# Altium schematic sheet MainBOB_RUDRV2.SchDoc
size 558 x 431 mm; SheetNumber: 1; SheetTotal: 2
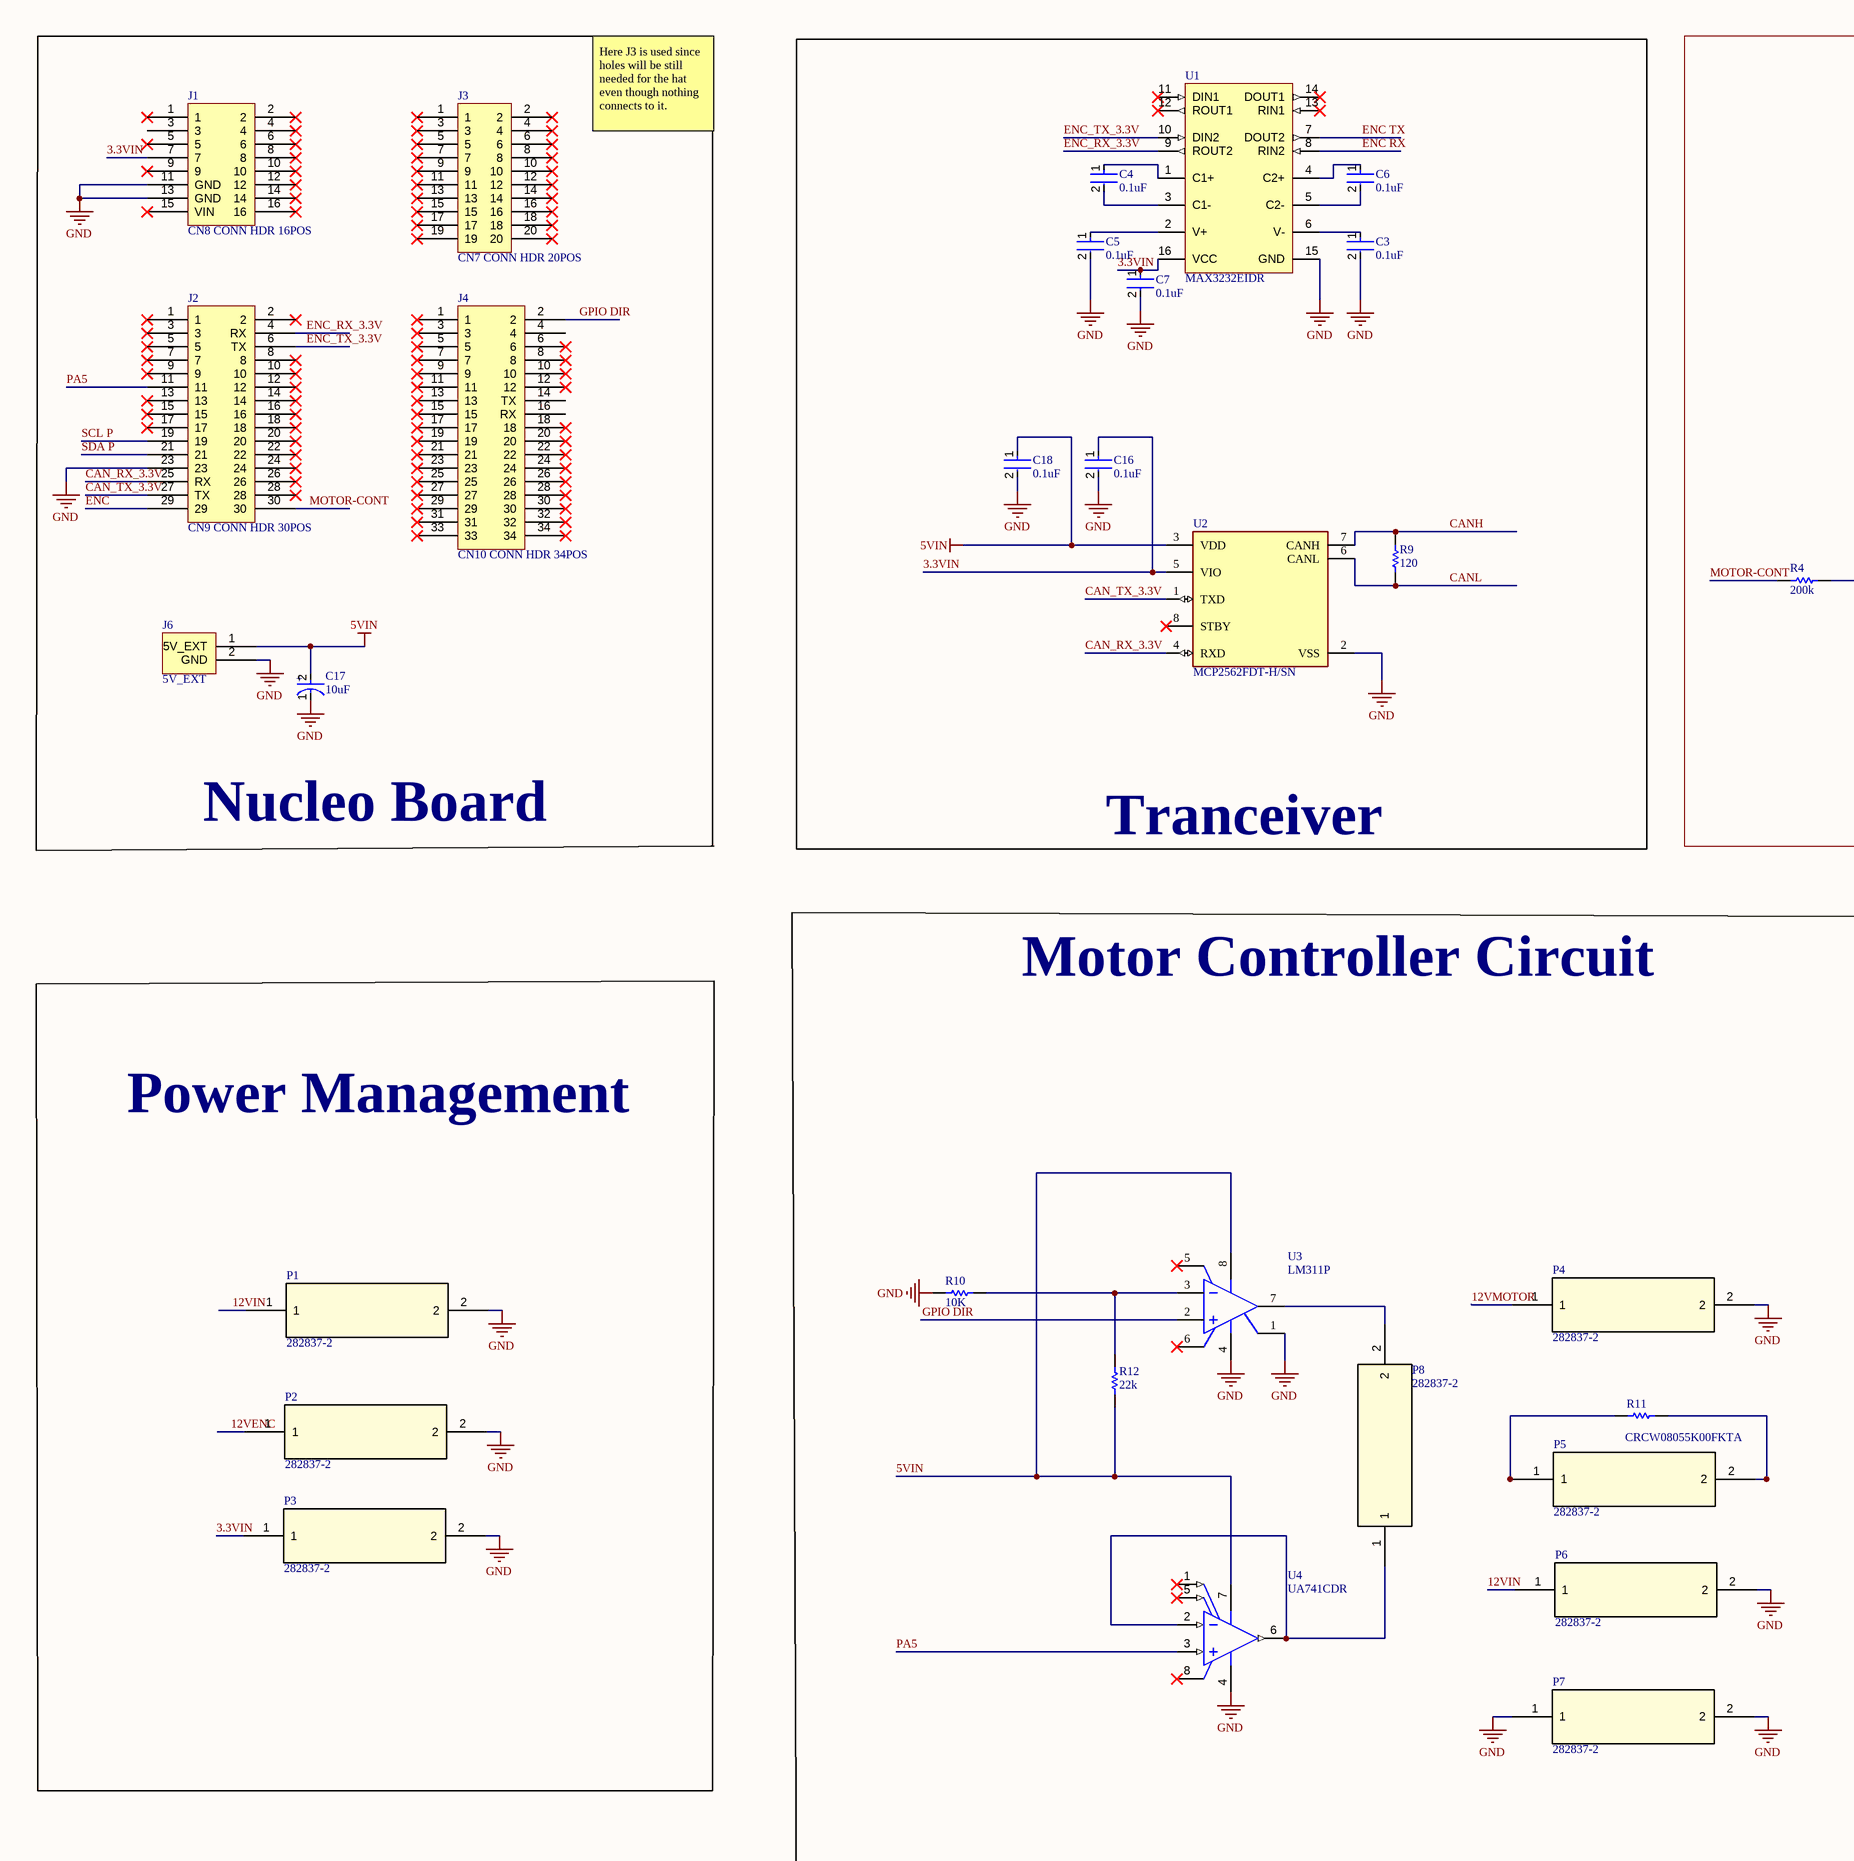
[diagram p0: MainBOB_RUDRV2.SchDoc, left]
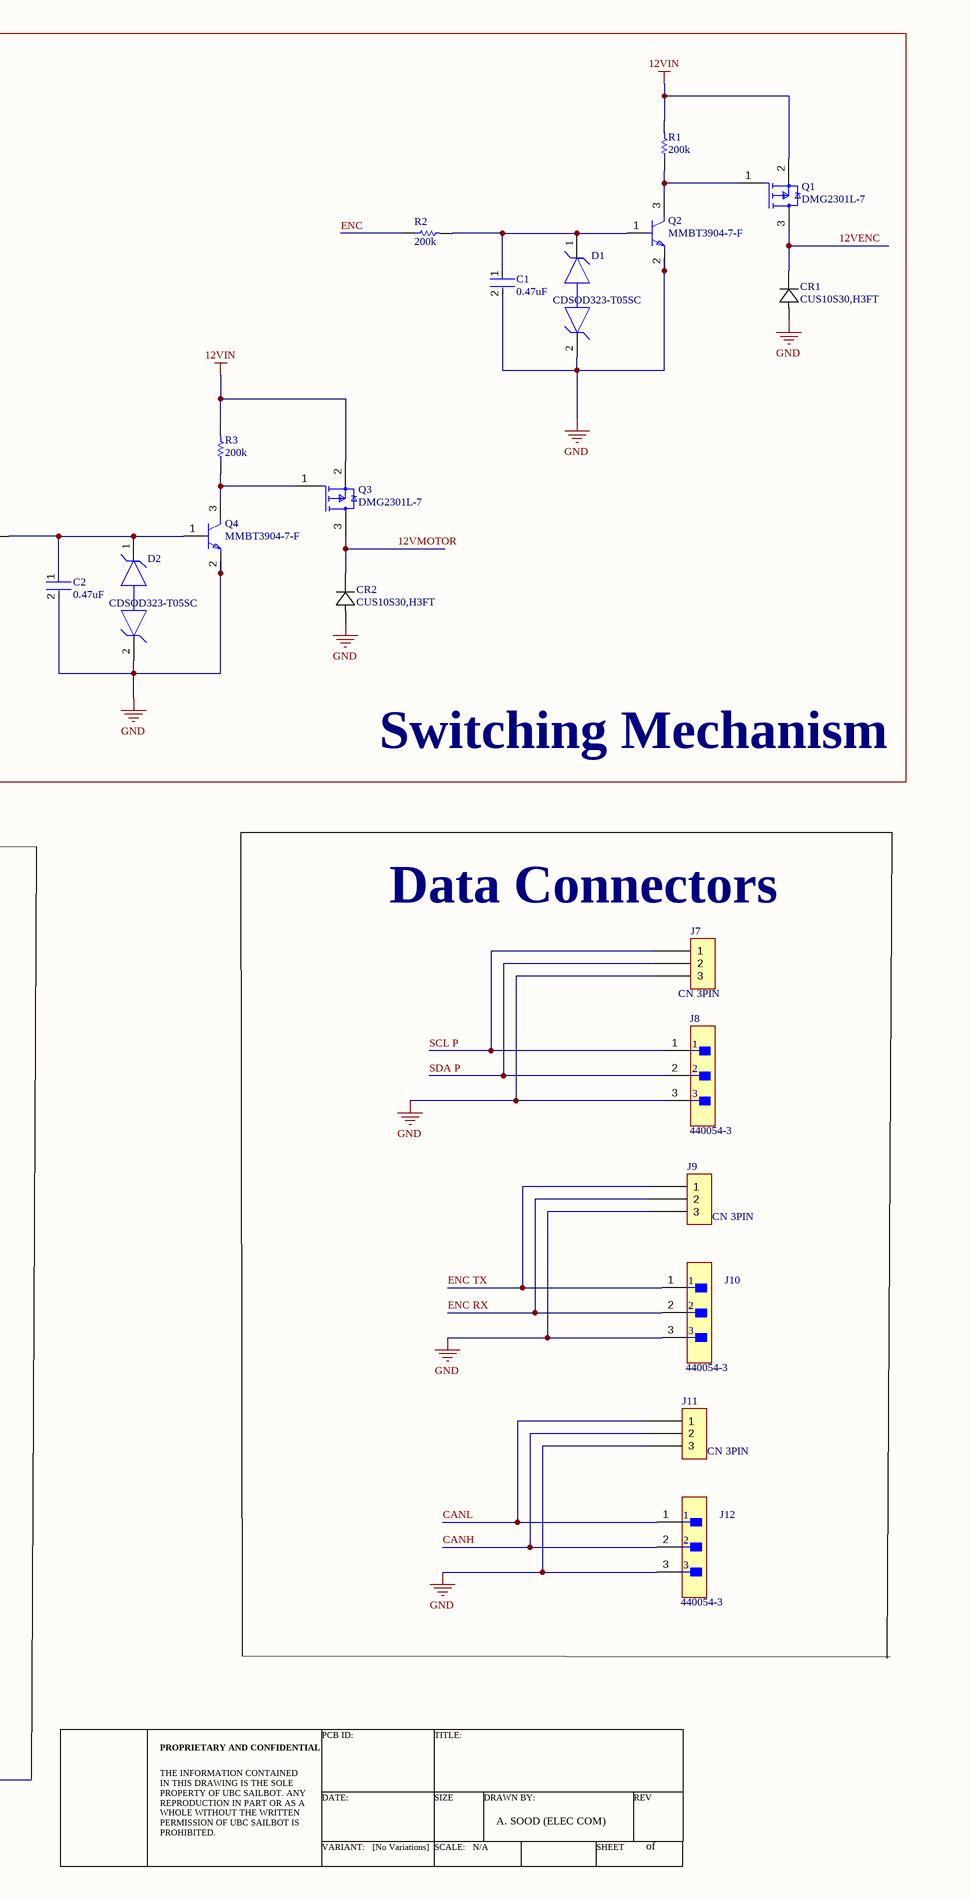
[diagram p1: MainBOB_RUDRV2.SchDoc, right]

## Parts
*  Title Block  (value not drawn)
C1  0.47uF  [FP-GRM21B-0_15-IPC_B]
C2  0.47uF  [FP-GRM21B-0_15-IPC_B]
C3  0.1uF  [FP-GCM21B-0_15-MFG]
C4  0.1uF  [FP-GCM21B-0_15-MFG]
C5  0.1uF  [FP-GCM21B-0_15-MFG]
C6  0.1uF  [FP-GCM21B-0_15-MFG]
C7  0.1uF  [FP-GCM21B-0_15-MFG]
C16  0.1uF  [FP-GCM21B-0_15-MFG]
C17  10uF  [FP-FKC-MFG]
C18  0.1uF  [FP-GCM21B-0_15-MFG]
CR1  CUS10S30,H3FT  [USC_TOS]
CR2  CUS10S30,H3FT  [USC_TOS]
D1  CDSOD323-T05SC  [FP-SOD-323-CA-MFG]
D2  CDSOD323-T05SC  [FP-SOD-323-CA-MFG]
J1  CN8 CONN HDR 16POS  [CN8_8X2_PADS]
J2  CN9 CONN HDR 30POS  [CN9_15X2_PADS]
J3  CN7 CONN HDR 20POS  [CN7_10X2_PADS]
J4  CN10 CONN HDR 34POS  [CN10_17X2_PADS]
J6  5V_EXT  [5V_EXT]
J7  CN 3PIN  [3X1 CON]
J8  440054-3  [FP-440054-3-MFG]
J9  CN 3PIN  [3X1 CON]
J10  440054-3  [FP-440054-3-MFG]
J11  CN 3PIN  [3X1 CON]
J12  440054-3  [FP-440054-3-MFG]
P1  282837-2  [282837-2_TYC]
P2  282837-2  [282837-2_TYC]
P3  282837-2  [282837-2_TYC]
P4  282837-2  [282837-2_TYC]
P5  282837-2  [282837-2_TYC]
P6  282837-2  [282837-2_TYC]
P7  282837-2  [282837-2_TYC]
P8  282837-2  [282837-2_TYC]
Q1  DMG2301L-7  [FP-SOT23-MFG]
Q2  MMBT3904-7-F  [FP-SOT23-IPC_A]
Q3  DMG2301L-7  [FP-SOT23-MFG]
Q4  MMBT3904-7-F  [FP-SOT23-IPC_A]
R1  200k  [RESC2013X70X40LL20T20]
R2  200k  [RESC2013X70X40LL20T20]
R3  200k  [RESC2013X70X40LL20T20]
R4  200k  [RESC2013X70X40LL20T20]
R9  120  [RESC2013X60X35ML10T20]
R10  10K  [RESC2013X60X40LL20T25_A]
R11  CRCW08055K00FKTA  [RESC2013X50X30ML20T20]
R12  22k  [RESC2013X60X40ML20T25]
U1  MAX3232EIDR  [D0016A_N]
U2  MCP2562FDT-H/SN  [FP-C04-057-SN-IPC_A]
U3  LM311P  [FP-P0008A-MFG]
U4  UA741CDR  [D0008A_L]

## Blocks framed on the sheet
Nucleo Board: C17 J1-J4 J6
Switching Mechanism: C1 C2 CR1 CR2 D1 D2 Q1-Q4 R1-R4
Tranceiver: C3-C7 C16 C18 R9 U1 U2
Power Management: P1-P3

## Nets
5VIN: C17.2(A) C18.1 J6.1(5V_EXT) R12.1 U2.3(VDD) U3.8(VCC+) U4.7(VCC+)
12VIN: P1.1 P6.1 Q1.2(S) Q3.2(S) R1.2 R3.2
GND: C1.2 C2.2 C3.2 C5.2 C7.2 C16.2 C17.1(C) C18.2 CR1.2(anode) CR2.2(anode) D1.2 D2.2 J1.11(GND) J1.13(GND) J2.23 J6.2(GND) J7.3 J8.3 J9.3 J10.3 J11.3 J12.3 P1.2 P2.2 P3.2 P4.2 P6.2 P7.1 P7.2 Q2.2(E) Q4.2(E) R10.1 U1.15(GND) U2.2(VSS) U3.1(EMIT_OUT) U3.4(VCC-) U4.4(VCC-)
3.3VIN: C7.1 C16.1 J1.7 P3.1 U1.16(VCC) U2.5(VIO)
12VENC: CR1.1(cathode) P2.1 Q1.3(D)
12VMOTOR: CR2.1(cathode) P4.1 Q3.3(D)
CAN_RX_3.3V: J2.25(RX) U2.4(RXD)
CAN_TX_3.3V: J2.27(TX) U2.1(TXD)
CANH: J11.2 J12.2 R9.1 U2.7(CANH)
CANL: J11.1 J12.1 R9.2 U2.6(CANL)
ENC: J2.29 R2.1
ENC RX: J9.2 J10.2 U1.8(RIN2)
ENC TX: J9.1 J10.1 U1.7(DOUT2)
ENC_RX_3.3V: J2.4(RX) U1.9(ROUT2)
ENC_TX_3.3V: J2.6(TX) U1.10(DIN2)
GPIO DIR: J4.2 U3.2(IN+)
MOTOR-CONT: J2.30 R4.1
PA5: J2.11 U4.3(IN+)
SCL P: J2.19 J7.1 J8.1
SDA P: J2.21 J7.2 J8.2
NetC1_1: C1.1 D1.1 Q2.1(B) R2.2
NetC2_1: C2.1 D2.1 Q4.1(B) R4.2
NetC3_1: C3.1 U1.6(V-)
NetC4_1: C4.1 U1.1(C1+)
NetC4_2: C4.2 U1.3(C1-)
NetC5_1: C5.1 U1.2(V+)
NetC6_1: C6.1 U1.4(C2+)
NetC6_2: C6.2 U1.5(C2-)
NetP5_1: P5.1 R11.1
NetP5_2: P5.2 R11.2
NetP8_1: P8.1 U4.2(IN-) U4.6(OUT)
NetP8_2: P8.2 U3.7(COL_OUT)
NetQ1_1: Q1.1(G) Q2.3(C) R1.1
NetQ3_1: Q3.1(G) Q4.3(C) R3.1
NetR10_2: R10.2 R12.2 U3.3(IN-)

Not connected (* = marked no-connect by the designer): J1 1* 2* 3 4* 5* 6* 8* 9* 10* 12* 14* 15(VIN)* 16*; J2 1* 2* 3* 5* 7* 8* 9* 10* 12* 13* 14* 15* 16* 17* 18* 20* 22* 24* 26* 28*; J3 1* 2* 3* 4* 5* 6* 7* 8* 9* 10* 11* 12* 13* 14* 15* 16* 17* 18* 19* 20*; J4 1* 3* 4 5* 6* 7* 8* 9* 10* 11* 12* 13* 14(TX) 15* 16(RX) 17* 18* 19* 20* 21* 22* 23* 24* 25* 26* 27* 28* 29* 30* 31* 32* 33* 34*; U1 11(DIN1)* 12(ROUT1)* 13(RIN1)* 14(DOUT1)*; U2 8(STBY)*; U3 5(BALANCE)* 6(BAL/STRB)*; U4 1(OFFSET_N1)* 5(OFFSET_N2)* 8(NC)*

## Notes on the sheet
- Here J3 is used since holes will be still needed for the hat even though nothing connects to it.
- Motor Controller Circuit
- (near J7) Data Connectors
- C
- of
- DWG. NO.
- REV.
- SHT.
- REVISION
- DESCRIPTION
- DATE
- APPROVED
- THIS DOCUMENT AND THE DATA DISCLOSED HEREIN OR HEREWITH IS THE PROPERTY OF ALTIUM LIMITED AND MAY BE FREELY DISTRIBUTED IN WHOLE. NO RIGHTS ARE RESERVED OR EXPRESS OR IMPLIED WARANTEE GIVEN.
- ENG:
- DSN:
- APPROVALS
- PROJECT
- DOCUMENT REVISION:
- DESIGN ITEM:
- CHK:
- BOM:
- REFERENCE DOCUMENTS
- PROJECT REVISION:
- TITLE
- FAB DWG:
- PCB DWG:
- ASSY DWG:
- SCALE:
- SIZE
- CAGE CODE
- FILE NAME
- DWG NO.
- SHEET
- OF
- REV
- (in symbol CMP-05427-000030-1) +
- (in symbol Title Block) PCB ID:; TITLE:; PROPRIETARY AND CONFIDENTIAL; DATE:; SIZE; DRAWN BY:; REV; A. SOOD (ELEC COM); A; THE INFORMATION CONTAINED IN THIS DRAWING IS THE SOLE PROPERTY OF UBC SAILBOT. ANY REPRODUCTION IN PART OR AS A WHOLE WITHOUT THE WRITTEN PERMISSION OF UBC SAILBOT IS PROHIBITED.; VARIANT:   [No Variations]; SCALE:   N/A; SHEET

## Library data of the parts
C1 C2 = CMP-2007-03605-2: Chip Multilayer Ceramic Capacitors for General Purpose, 0805, 0.47uF, X7R, 15%, 10%, 100V; Capacitance: 470nF; Max Operating Temperature: 125°C; Dielectric: X7R; Length: 2mm; Case/Package: 0805; Case Code (Metric): 2012; Package Quantity: 1; Case Code (Imperial): 0805; REACH SVHC: No SVHC; Termination: SMD/SMT; Voltage Rating: 100V; Mount: Surface Mount; Depth: 1.25mm; Radiation Hardening: No; Width: 1.25mm; Material: Ceramic; Voltage: 100V; Voltage Rating (DC): 100V; Min Operating Temperature: -55°C; Thickness: 0.053inch; Packaging: Tape and Reel; Height: 1.25mm; Lead Free: Lead Free; Tolerance: 10%
C3-C7 C16 C18 = CMP-2007-03364-2: Ceramic Capacitor for Automotive 100nF ±10% 100VDC X7R 0805 Embossed T/R; Voltage Rating: 100V; Termination: SMD/SMT; Tolerance: 10%; Case Code (Imperial): 0805; Length: 2mm; Max Operating Temperature: 125°C; Case/Package: 0805; Mount: Surface Mount; Packaging: Tape and Reel; Package Quantity: 1; Min Operating Temperature: -55°C; Case Code (Metric): 2012; Radiation Hardening: No; REACH SVHC: No SVHC; Dielectric: X7R; Depth: 1.25mm; Lead Free: Lead Free; Ratings: AEC-Q200; Height: 1.25mm; Voltage: 100V; Capacitance: 100nF; Voltage Rating (DC): 100V; Width: 0.049inch; Thickness: 0.055inch
C17 = CMP-05427-000030-1: CAP ALUM 10UF 20% 50V SMD; Impedance: 1.52R; Ripple Current (AC): 85mA; Life (Hours): 2000Hour; Leakage Current: 3uA; Dielectric Material: Aluminium; Length: 5.8mm; Voltage Rating: 50V; Radiation Hardening: No; Max Operating Temperature: 105°C; REACH SVHC: No SVHC; Tolerance: 20%; RoHS Compliant: Yes; Case/Package: Radial; Height: 5.8mm; Voltage: 50V; Diameter: 5mm; Number of Pins: 2; Ripple Current: 85mA; Series: FK; Lead Free: Lead Free; Width: 6.5mm; ESR (Equivalent Series Resistance): 1.52R; Package Quantity: 1000; Construction: Cylindrical; Voltage Rating (DC): 50V; Packaging: Tape and Reel; Height - Seated (Max): 0.228inch; Contact Plating: Tin; Capacitance: 10uF; Min Operating Temperature: -55°C; Termination: SMD/SMT; Material: Aluminium; Mount: Surface Mount
CR1 CR2 = CUS10S30,H3FT: No Description Available; Mfr_Name: Toshiba Electronic Devices & Storage Corp.
D1 D2 = CMP-07401-000040-1: TVS DIODE 5VWM 14.5VC SOD323; Direction: Bidirectional; Number of Bidirectional Channels: 1; Clamping Voltage: 13.5V; Diode Type: ZENER; Element Configuration: Single; Power Line Protection: No; Leakage Current: 10uA; Max Power Dissipation: 400W; Test Current: 1mA; Peak Pulse Current: 28A; Working Voltage: 5V; Min Breakdown Voltage: 6V; Capacitance: 350pF; Peak Pulse Power: 500W; Mount: Surface Mount; Contact Plating: Tin; Max Operating Temperature: 150°C; Min Operating Temperature: -55°C; Packaging: Tape and Reel; REACH SVHC: No SVHC; Length: 1.9mm; RoHS Compliant: Yes; Series: CDSOD323; Number of Channels: 1; Number of Elements: 1; Reverse Standoff Voltage: 5V; Termination: SMD/SMT; Number of Pins: 2; Max Breakdown Voltage: 6V; Package Quantity: 3000; Depth: 1.45mm; Polarity: Bidirectional; Radiation Hardening: No; Max Surge Current: 28A; Breakdown Voltage: 6V; Reverse Breakdown Voltage: 6V; Resistor Type: Zener; Operating Supply Voltage: 5V
J1 = CN8 CONN HDR 16POS: CN8 CONN HDR 16POS 0.1 STACK
J2 = CN9 CONN HDR 30POS: CN9 CONN HDR 30 POS  0.1 STACK
J3 = CN7 CONN HDR 20POS: CN7 CONN HDR 20 POS  0.1 STACK
J4 = CN10 CONN HDR 34POS: CN10 CONN HDR 34 POS  0.1 STACK
J8 J10 J12 = CMP-03369-000008-1: CONN HEADER VERT 3POS 2MM; Manufacturer: TE Connectivity; Voltage Rating: 250V; Number Of Contacts: 3; Conn Gender: Male; Conn Orientation: Vertical; Current Rating: 3A; Octopart: https://octopart.com/440054-3-te+connectivity-40394845; Device Class L3: unset; Device Class L1: Connectors; Number Of Rows: 1; Temperature: -25°C to +105°C; Temperature Range Low: -25°C; Automotive: No; Package: 0; Manufacturer Part Number: 440054-3; ComponentLink2URL: https://www.te.com/usa-en/product-440054-3.datasheet.pdf; Device Class L2: Headers and Wire Housings; Temperature Range High: +105°C; Digikey Description: CONN HEADER VERT 3POS 2MM; Contact Material: Tin,Nickel; Footprint Url: https://www.te.com/commerce/DocumentDelivery/DDEController?Action=showdoc&DocId=Customer+Drawing%7F440054%7FF6%7Fpdf%7FEnglish%7FENG_CD_440054_F6.pdf%7F440054-3; RoHS: TRUE; ComponentLink2Description: Datasheet; Mouser Description: Headers & Wire Housings 3 POS HDR VERT 2.0mm; Lead Free: Yes; Category: Conn; Height: 6.35mm; Pitch: 2mm
P1-P8 = 282837-2: No Description Available; Mfr_Name: TE Connectivity; RefDes: RefDes; Type: Type
Q1 Q3 = CMP-12801-000065-1: MOSFET P-CH 20V 3A SOT23; Manufacturer: Diodes Inc.; Number Of Channels: 1; Turn On Delay Time: 5ns; Drain To Source Resistance: 120mΩ; Max Junction Temp: +150°C; Gate To Source Voltage: 8V; Power Dissipation: 1.5W; Rthja Max: 83°C/W; Max Forward Diode Voltage: -1.2V; Standoff Height: 0.013mm; Threshold Vgs Min: -0.4V; Input Capacitace At Vds: 476pF @ -10V; Depletion Mode: False; Gate Charge At Vgs: 5.5nC @ -4.5V; Pulse Drain Current: -10A; Drain To Source Voltage: -20V; Continuous Drain Current: -3A; Turn Off Delay Time: 30ns; Lead Free: Yes; Package: SOT23; ComponentLink2Description: Datasheet; Device Class L3: MOSFETs; Device Class L1: Discrete Semiconductors; Manufacturer Part Number: DMG2301L-7; Automotive: No; Height: 1.1mm; Category: Trans; Temperature Range High: +150°C; Digikey Description: MOSFET P-CH 20V 3A SOT23; RoHS: TRUE; Number Of P Channels: 1; Footprint Url: https://www.diodes.com/assets/Package-Files/SOT23.pdf; Octopart: https://octopart.com/dmg2301l-7-diodes+inc.-67250456; ComponentLink2URL: https://www.diodes.com/assets/Datasheets/DMG2301L.pdf; Mouser Description: Single P-Channel 20 V 1.5 W 5.5 nC Silicon Surface Mount Mosfet - SOT-23; Drain To Source Breakdown Voltage: -20V; Threshold Vgs Max: -1.2V; Device Class L2: Transistors; Temperature: -55°C to +150°C; Temperature Range Low: -55°C
Q2 Q4 = CMP-2000-04931-2: TRANS NPN 40V 0.2A SMD SOT23-3; Frequency: 300MHz; Power Dissipation: 350mW; Element Configuration: Single; Max Power Dissipation: 300mW; Max Collector Current: 200mA; Collector Emitter Saturation Voltage: 300mV; Number of Elements: 1; hFE Min: 100; Collector Base Voltage (VCBO): 60V; Emitter Base Voltage (VEBO): 6V; Contact Plating: Tin; Package Quantity: 3000; Max Frequency: 300MHz; REACH SVHC: No SVHC; Max Operating Temperature: 150°C; Width: 1.4mm; Collector Emitter Voltage (VCEO): 40V; Voltage Rating (DC): 40V; Radiation Hardening: No; Case/Package: SOT-23; Height: 1mm; Collector Emitter Breakdown Voltage: 40V; Length: 3.05mm; Polarity: NPN; Packaging: Tape and Reel; Number of Pins: 3; Min Operating Temperature: -55°C; Gain Bandwidth Product: 300MHz; Mount: Surface Mount; Weight: 0.000282oz; Continuous Collector Current: 200mA; Transition Frequency: 300MHz; Max Breakdown Voltage: 40V; Lead Free: Lead Free
R1-R4 = CMP-2001-00028-1: Manufacturer: Panasonic; Part Number: ERJ-6ENF2003V
R9 = CMP-2100-03671-1: Chip Resistor, 1 KOhm, +/- 1%, 125 mW, -55 to 155 degC, 0805 (2012 Metric), RoHS, Tape and Reel; Manufacturer: Yageo; Temperature Coefficient: 100ppm/degreesC; Voltage Rating (DC): 150V; Max Power Dissipation: 125mW; Resistance: 1KOhm; Number of Pins: 2; Number of Terminations: 2; Datasheet URL: http://www.yageo.com/NewPortal/yageodocoutput?fileName=/pdf/R-Chip/PYu-RC_Group_51_RoHS_L_5.pdf; Length: 0.079inch; Package Description: 2-Pin Surface Mounted Device, Body 2 x 1.25 mm; Depth: 1.25mm; Height: 0.024inch; Military Standard: Not; Case/Package: 0805; Package Reference: 0805; RoHSCompliant: true; Lead Free: LeadFree; Packaging: TapeandReel; Package Quantity: 1; Datasheet Version: Rev. 5, 10/2016; Tolerance: 1%; Min Operating Temperature: -55degC; Voltage Rating: 150V; Composition: ThickFilm; Case Code (Imperial): 0805; Power Rating: 125mW; Width: 0.049inch; Case Code (Metric): 2012; Manufacturer URL: http://www.yageo.com/; Max Operating Temperature: 155degC; REACH SVHC: Unknown; Termination: SMD/SMT
R10 = CMP-2001-00582-2: Metal Film Chip Resistor, High Reliability Type, 0.125 W, +/- 0.1%, -55 to 155 degC, 0805 (2012 Metric), RoHS, Tape and Reel; Voltage Rating: 100V; Power Rating: 125mW(1/8W); Brand: Panasonic; Temperature Coefficient: 25PPM/C; Resistance: 10kOhms; Product Category: ThinFilmResistors-SMD; Datasheet Version: 02/2016; Operating Temperature Range: -55Cto+155C; Length: 2mm; Mounting Technology: SurfaceMount; Manufacturer URL: http://www.panasonic.com/; Width: 1.25mm; Packaging: Reel; Product: ThinFilmResistorsSMD; Package / Case: 0805(2012metric); Termination Style: SMD/SMT; Tolerance: 0.1%; Datasheet URL: https://industrial.panasonic.com/cdbs/www-data/pdf/RDM0000/AOA0000C307.pdf; Package Description: 2-Pin Surface Mount Device, Body 2 x 1.25 mm; Factory Pack Quantity: 5000; Series: ERA-6A; Case Code - mm: 2012; RoHS: Details; Package Reference: 0805; Height: 0.5mm; Manufacturer: Panasonic; Case Code - in: 0805; Type: MetalFilmChipResistors
R11 = CMP-2001-04239-1: Manufacturer: Vishay Dale; Part Number: CRCW08055K00FKTA
R12 = CMP-2001-00614-1: Manufacturer: Panasonic; Part Number: ERA6AEB223V
U1 = CMP-0299-00792-2: 3-V to 5.5-V Multichannel RS-232 Line Driver / Receiver with ±15-kV IEC ESD Protection, -40 to 85 degC, 16-Pin SOIC (D), Green (RoHS & no Sb/Br); Drivers Per Package: 2; IEC-61000-4-2 SUPPORT: TRUE; Supply Voltage(s)(V): 3.3 or 5.0; ICC(Max)(mA): 1; ESD HBM(kV): +/-15; PackageVersion: revM, Jun-2011; ComponentLink2URL: http://www.ti.com/general/docs/lit/getliterature.tsp?genericPartNumber=MAX3232E&fileType=pdf; PackageReference: D0016A; DatasheetVersion: SLLS664A; ComponentLink3Description: Package Specification; PackageDescription: 16-Pin Plastic Small Outline Integrated Circuit, 9.9 x 3.9 mm, Pitch 1.27 mm Pitch; SubFamily: RS-232; Single Supply: TRUE; RS-232: TRUE; ComponentLink1Description: Manufacturer URL; ComponentLink1URL: www.ti.com; ComponentLink3URL: http://www.ti.com/litv/pdf/mpds178g; Receivers Per Package: 2; ComponentLink2Description: Datasheet
U2 = CMP-06279-000047-1: IC TRANSCEIVER 1/1 8SOIC; Operating Supply Current: 70mA; Receiver Hysteresis: 200mV; Max Supply Voltage: 5.5V; Number of Transceivers: 1; Min Supply Voltage: 4.5V; Data Rate: 8Mbps; Case/Package: SOIC; Weight: 0.019048oz; Package Quantity: 3300; Max Operating Temperature: 150°C; Packaging: Tape and Reel; RoHS Compliant: Yes; Series: -; Number of Pins: 8; Min Operating Temperature: -40°C; Mount: Surface Mount
U3 = CMP-1685-00016-2: Manufacturer Lifecycle Status: ACTIVE; NexarPartId: 24336; Output Type: TTL; Max Output Voltage: 7.5mV; Min Supply Voltage: 3.5V; Min Dual Supply Voltage: 1.75V; Max Supply Current: 7.5mA; Number of Elements: 1; Response Time: 165ns; Max Dual Supply Voltage: 15V; Max Supply Voltage: 30V; Max Junction Temperature (Tj): 150°C; Max Power Dissipation: 500mW; Input Offset Voltage (Vos): 2mV; Resistance: 390Ω; Operating Supply Voltage: 28V; Power Rating: 100mW; Dual Supply Voltage: 9V; Output Current per Channel: 50mA; Turn-On Delay Time: 115ns; Tolerance: 1%; Voltage Gain: 106.02dB; Input Bias Current: 250nA; Voltage Rating: 75V; Contact Plating: Gold; Case Code (Imperial): 0603; Number of Circuits: 1; Lifecycle Status: Production; Ambient Temperature Range High: 70°C; Radiation Hardening: No; Quiescent Current: 7.5mA; Number of Channels: 1; Max Operating Temperature: 70°C; Height: 5.08mm; Type: General Purpose; Case Code (Metric): 1608; Mount: Surface Mount, Through Hole; Case/Package: PDIP; Thickness: 3.9mm; REACH SVHC: No SVHC; Length: 9.81mm; RoHS: Compliant; Schedule B: 8542390000, 8542390000; Lead Free: Lead Free; Min Operating Temperature: 0°C; Width: 6.35mm; Output Current: 50mA; Packaging: Tape and Reel; Nominal Supply Current: 7.5mA; Weight: 2.012816mg; Propagation Delay: 115ns; Max Input Current: 250nA; Number of Pins: 8
U4 = CMP-0017-00239-2: General-Purpose Operational Amplifier, 7 to 36 V, 0 to 70 degC, 8-pin SOIC (D8), Green (RoHS & no Sb/Br); Manufacturer: Texas Instruments; Slew Rate(Typ)(V/us): 0.5; CMRR(Min)(dB): 70; Iq per channel(Max)(mA): 2.8; Total Supply Voltage(Min)(+5V is 5, +/-5V is 10): 7; Total Supply Voltage(Max)(+5V is 5, +/-5V is 10): 36; GBW(Typ)(MHz): 1; Vio (25C)(Max)(mV): 6; Sub Family: General Purpose Amplifier, High Supply Voltage Amplifier (>=30V); IIB(Max)(pA): 1500000; PackageDescription: 8-Pin Plastic Small Outline, Body 4.9 x 3.9 mm, Pitch 1.27 mm; DatasheetVersion: SLOS094B; ComponentLink2URL: http://www.ti.com/lit/ds/symlink/ua741.pdf; PackageVersion: 4040047-3/M, 06/2011; Mounting Technology: Surface Mount; Code_JEDEC: MS-012; ComponentLink3URL: http://www.ti.com/litv/pdf/msoi002j; ComponentLink1URL: http://www.ti.com/; PackageReference: D0008A; ComponentLink1Description: Manufacturer URL; Eco-Plan: Green (RoHS & no Sb/Br); PartNumber: UA741CDR; ComponentLink2Description: Datasheet; Number of Channels: 1; ComponentLink3Description: Package Specification